# Altium schematic sheet 5V5_to_5V0_LDO.SchDoc
size A; SheetNumber: 5; SheetTotal: 15
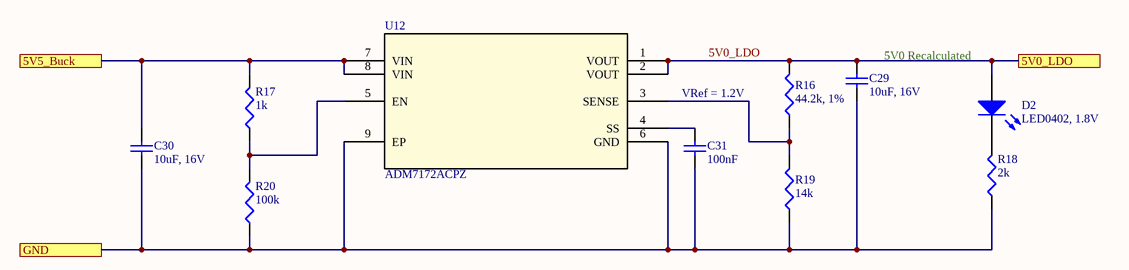
[diagram p0: 5V5_to_5V0_LDO.SchDoc]

## Parts
C29  10uF, 16V  [SMD-0603]
C30  10uF, 16V  [SMD-0603]
C31  100nF  [SMD-0402]
D2  LED0402, 1.8V  [LED-0402]
R16  44.2k, 1%  [SMD-0402]
R17  1k  [SMD-0402]
R18  2k  [SMD-0402]
R19  14k  [SMD-0402]
R20  100k  [SMD-0402]
U12  ADM7172ACPZ  [ADM7172_VIA_NOSILK]

## Ports
5V0_LDO (see IQ_Demod[2D]), 5V5_Buck (see IQ_Demod[2D]), GND (see IQ_Demod[2D], 3V7_to_3V3_LDO[1B], Buck_TPSM82913_1V8[3C], Buck_TPSM82913_3V7[3C], Buck_TPSM82913_5V0[3C], Buck_TPSM82913_5V5[2C], Clocking_and_LO[2A], Fan_Interfaces[2B], IQ_Demod[1C], IQ_Mod[1B], LMX2820[4D], Microzed_Interfaces[1A], Power_Supply[6B], Voltage_Conv_Bidirectional[1B])

## Nets
5V0_LDO: C29.2 D2.1(A) R16.2 U12.1(VOUT) U12.2(VOUT) ; port 5V0_LDO
5V5_Buck: C30.2 R17.2 U12.7(VIN) U12.8(VIN) ; port 5V5_Buck
GND: C29.1 C30.1 C31.1 R18.1 R19.1 R20.1 U12.6(GND) U12.9(EP) ; port GND
NetC31_2: C31.2 U12.4(SS)
NetD2_2: D2.2(K) R18.2
NetR16_1: R16.1 R19.2 U12.3(SENSE)
NetR17_1: R17.1 R20.2 U12.5(EN)

## Notes on the sheet
- 5V0 Recalculated
- VRef = 1.2V

## Library data of the parts
C29 C30 = CAP0603: Ceramic Capacitor 0603
C31 = CAP0402: Ceramic Capacitor 0402
D2 = LED0402: LED 0402
R16-R20 = RES0402: Resistor-0402
U12 = ADM7172ACPZ: 6.5V, 2A, Ultralow Noise, High PSRR, Fast Transient Response CMOS LDO; Value: Value; Type: Type; RefDes: RefDes